# EAGLE schematic untitled (EAGLE 9.6.2)
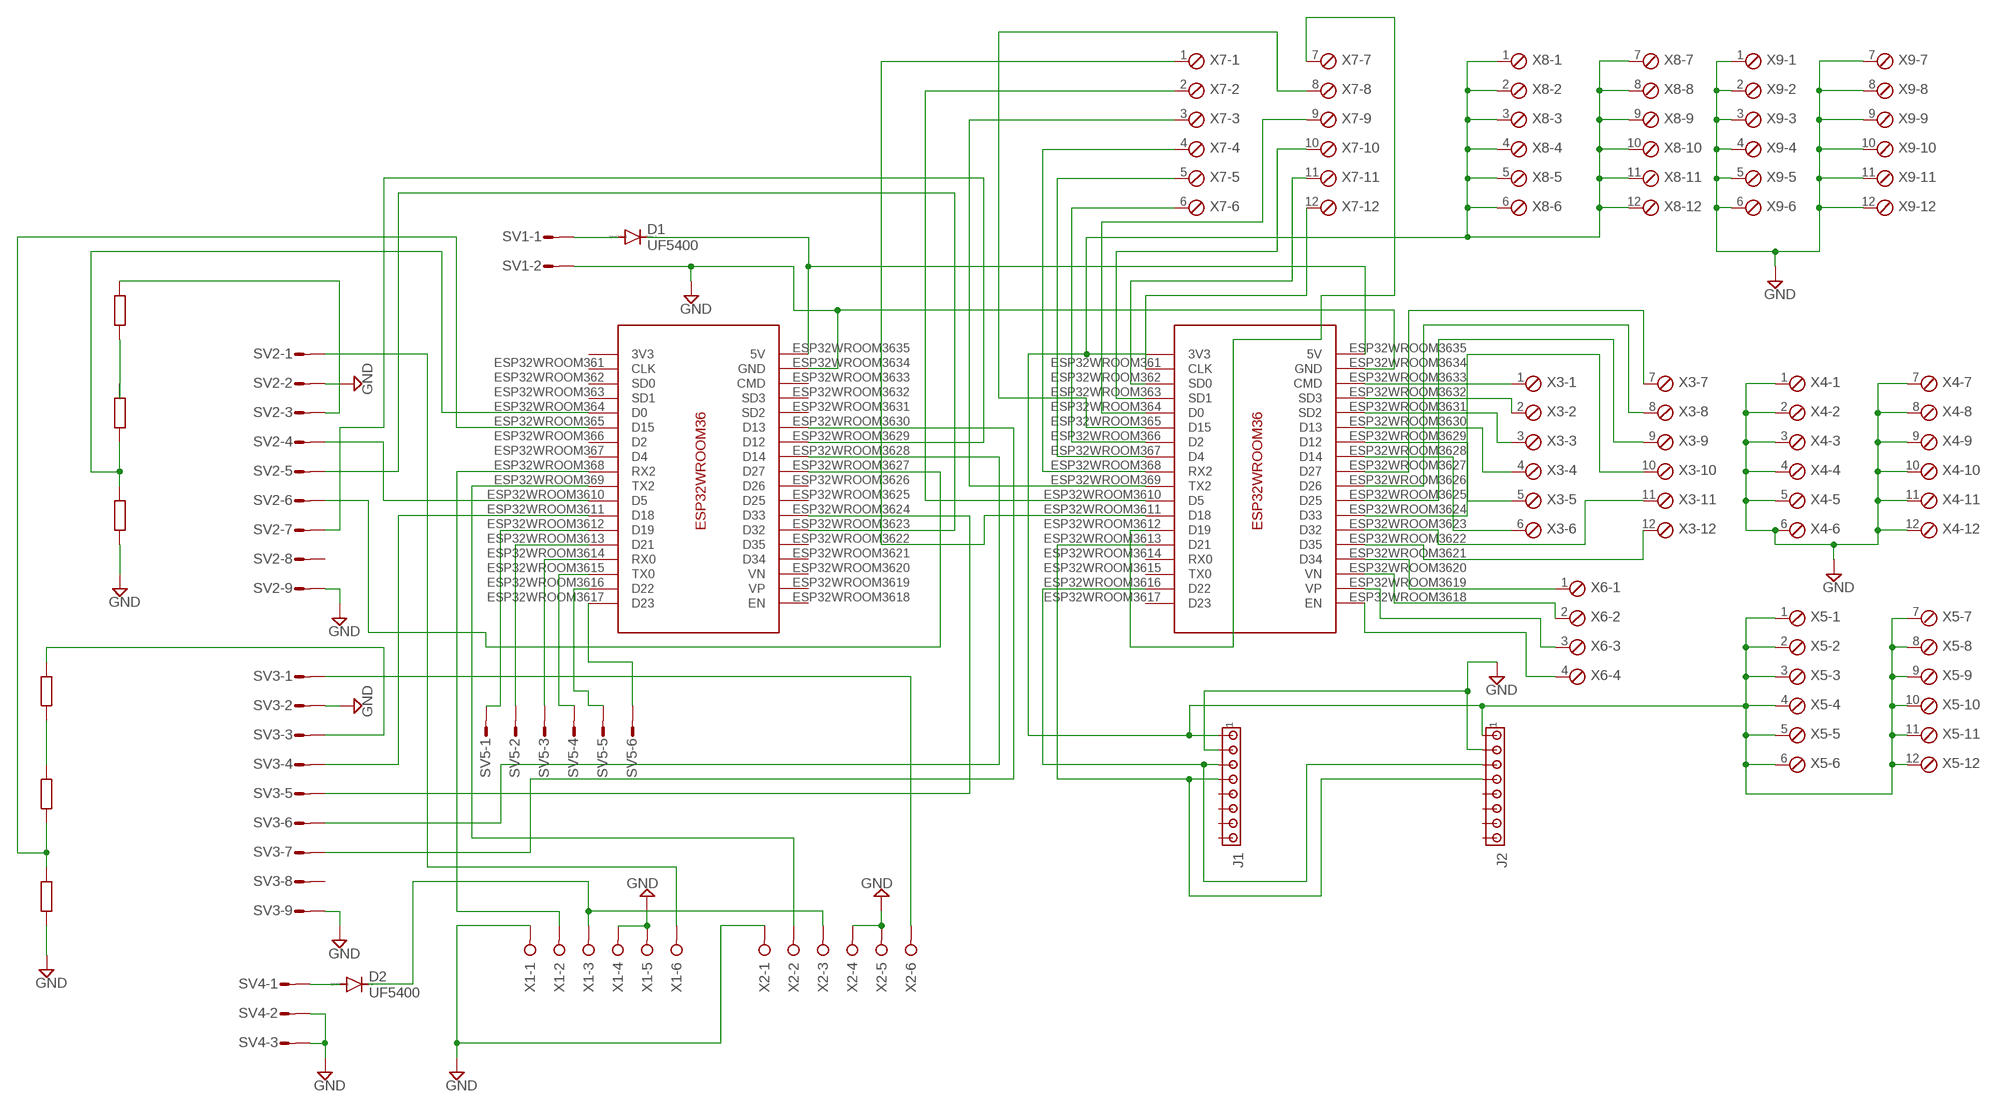
[diagram p0: schematic, sheet 1]

## Parts
D1  UF5400  [DO201-15]
D2  UF5400  [DO201-15]
J1  MTA08-100  [10X08MTA]
J2  MTA08-100  [10X08MTA]
SV1  L02P  [L02P]
SV2  L09P  [L09P]
SV3  L09P  [L09P]
SV4  L03P  [L03P]
SV5  L06P  [L06P]
U$1  ESP32WROOM36  [ESP32WROOM36PINDIP]
U$2  ESP32WROOM36  [ESP32WROOM36PINDIP]
X1  W237-06P  [W237-6P]
X2  W237-06P  [W237-6P]
X3  MPT12  [12POL254]
X4  MPT12  [12POL254]
X5  MPT12  [12POL254]
X6  MPT4  [4POL254]
X7  MPT12  [12POL254]
X8  MPT12  [12POL254]
X9  MPT12  [12POL254]

## Nets
GND: J1.2 J2.2 SV1.2 SV2.2 SV2.9 SV3.2 SV3.9 SV4.2 SV4.3 U$1.ESP32WROOM3634(GND) U$2.ESP32WROOM3634(GND) X1.1 X1.4 X1.5 X2.1 X2.4 X2.5 X4.1 X4.2 X4.3 X4.4 X4.5 X4.6 X4.7 X4.8 X4.9 X4.10 X4.11 X4.12 X9.1 X9.2 X9.3 X9.4 X9.5 X9.6 X9.7 X9.8 X9.9 X9.10 X9.11 X9.12
N$1: D1.C U$1.ESP32WROOM3635(5V) U$2.ESP32WROOM3635(5V)
N$2: SV2.1 X1.6
N$3: D2.A SV4.1
N$4: SV3.1 X2.6
N$6: SV2.6 U$1.ESP32WROOM3627(D27)
N$7: D1.A SV1.1
N$8: D2.C X1.3 X2.3
N$9: SV2.4 U$1.ESP32WROOM3610(D5)
N$10: U$1.ESP32WROOM368(RX2) X1.2
N$11: U$1.ESP32WROOM369(TX2) X2.2
N$12: SV2.3
N$13: U$1.ESP32WROOM365(D15)
N$15: SV3.3
N$16: U$1.ESP32WROOM364(D0)
N$17: SV3.4 U$1.ESP32WROOM3611(D18)
N$18: SV2.5 U$1.ESP32WROOM3623(D32)
N$19: SV3.5 U$1.ESP32WROOM3624(D33)
N$20: SV3.6 U$1.ESP32WROOM3628(D14)
N$21: SV2.7 U$1.ESP32WROOM3629(D12)
N$22: SV3.7 U$1.ESP32WROOM3630(D13)
N$23: J1.1 J2.1 U$2.ESP32WROOM360(3V3) X5.1 X5.2 X5.3 X5.4 X5.5 X5.6 X5.7 X5.8 X5.9 X5.10 X5.11 X5.12 X8.1 X8.2 X8.3 X8.4 X8.5 X8.6 X8.7 X8.8 X8.9 X8.10 X8.11 X8.12
N$24: U$2.ESP32WROOM3631(SD2) X3.3
N$25: U$2.ESP32WROOM3630(D13) X3.4
N$26: J1.3 J2.3 U$2.ESP32WROOM3616(D22)
N$27: J1.4 J2.4 U$2.ESP32WROOM3613(D21)
N$28: U$2.ESP32WROOM3629(D12) X3.5
N$29: U$2.ESP32WROOM3628(D14) X3.6
N$30: U$2.ESP32WROOM3633(CMD) X3.1
N$31: U$2.ESP32WROOM3632(SD3) X3.2
N$32: U$2.ESP32WROOM3627(D27) X3.7
N$33: U$2.ESP32WROOM3626(D26) X3.8
N$34: U$2.ESP32WROOM3625(D25) X3.9
N$35: U$2.ESP32WROOM3624(D33) X3.10
N$36: U$2.ESP32WROOM3623(D32) X3.11
N$37: U$2.ESP32WROOM3622(D35) X3.12
N$38: U$2.ESP32WROOM3621(D34) X6.1
N$39: U$2.ESP32WROOM3620(VN) X6.2
N$40: U$2.ESP32WROOM3619(VP) X6.3
N$41: U$2.ESP32WROOM361(CLK) X7.12
N$42: U$2.ESP32WROOM3618(EN) X6.4
N$43: U$2.ESP32WROOM362(SD0) X7.11
N$44: U$2.ESP32WROOM363(SD1) X7.10
N$45: U$2.ESP32WROOM364(D0) X7.9
N$46: U$2.ESP32WROOM366(D2) X7.6
N$47: U$2.ESP32WROOM367(D4) X7.5
N$48: U$2.ESP32WROOM368(RX2) X7.4
N$49: U$2.ESP32WROOM369(TX2) X7.3
N$50: U$2.ESP32WROOM3610(D5) X7.2
N$51: U$2.ESP32WROOM3611(D18) X7.1
N$52: U$2.ESP32WROOM365(D15) X7.8
N$53: U$2.ESP32WROOM3612(D19) X7.7
N$54: SV5.1 U$1.ESP32WROOM3612(D19)
N$55: SV5.2 U$1.ESP32WROOM3613(D21)
N$56: SV5.3 U$1.ESP32WROOM3614(RX0)
N$57: SV5.6 U$1.ESP32WROOM3617(D23)
N$58: SV5.5 U$1.ESP32WROOM3616(D22)
N$59: SV5.4 U$1.ESP32WROOM3615(TX0)
Unconnected: J1.5 J1.6 J1.7 J1.8 J2.5 J2.6 J2.7 J2.8 SV2.8 SV3.8 U$1.ESP32WROOM360(3V3) U$1.ESP32WROOM361(CLK) U$1.ESP32WROOM362(SD0) U$1.ESP32WROOM363(SD1) U$1.ESP32WROOM366(D2) U$1.ESP32WROOM367(D4) U$1.ESP32WROOM3618(EN) U$1.ESP32WROOM3619(VP) U$1.ESP32WROOM3620(VN) U$1.ESP32WROOM3621(D34) U$1.ESP32WROOM3622(D35) U$1.ESP32WROOM3625(D25) U$1.ESP32WROOM3626(D26) U$1.ESP32WROOM3631(SD2) U$1.ESP32WROOM3632(SD3) U$1.ESP32WROOM3633(CMD) U$2.ESP32WROOM3614(RX0) U$2.ESP32WROOM3615(TX0) U$2.ESP32WROOM3617(D23)

## Library data of the parts
D1 D2 = diode:UF5400: DIODE ultra fast rectifier, 3 A
J1 J2 = con-amp:MTA08-100: AMP connector
SV1 = con-amp-mt:L02P: AMP MT CONNECTOR; OC_FARNELL: unknown; OC_NEWARK: unknown
SV2 SV3 = con-amp-mt:L09P: AMP MT CONNECTOR; OC_FARNELL: unknown; OC_NEWARK: unknown
SV4 = con-amp-mt:L03P: AMP MT CONNECTOR; OC_FARNELL: unknown; OC_NEWARK: unknown
SV5 = con-amp-mt:L06P: AMP MT CONNECTOR; OC_FARNELL: unknown; OC_NEWARK: unknown
U$1 U$2 = ESP32WROOM36:ESP32WROOM36
X1 X2 = con-wago-508:W237-06P: WAGO SREW CLAMP; OC_FARNELL: unknown; OC_NEWARK: unknown
X3-X5 X7-X9 = con-phoenix-254:MPT12: PHOENIX CONNECTOR; OC_FARNELL: unknown; OC_NEWARK: unknown
X6 = con-phoenix-254:MPT4: PHOENIX CONNECTOR; OC_FARNELL: unknown; OC_NEWARK: unknown